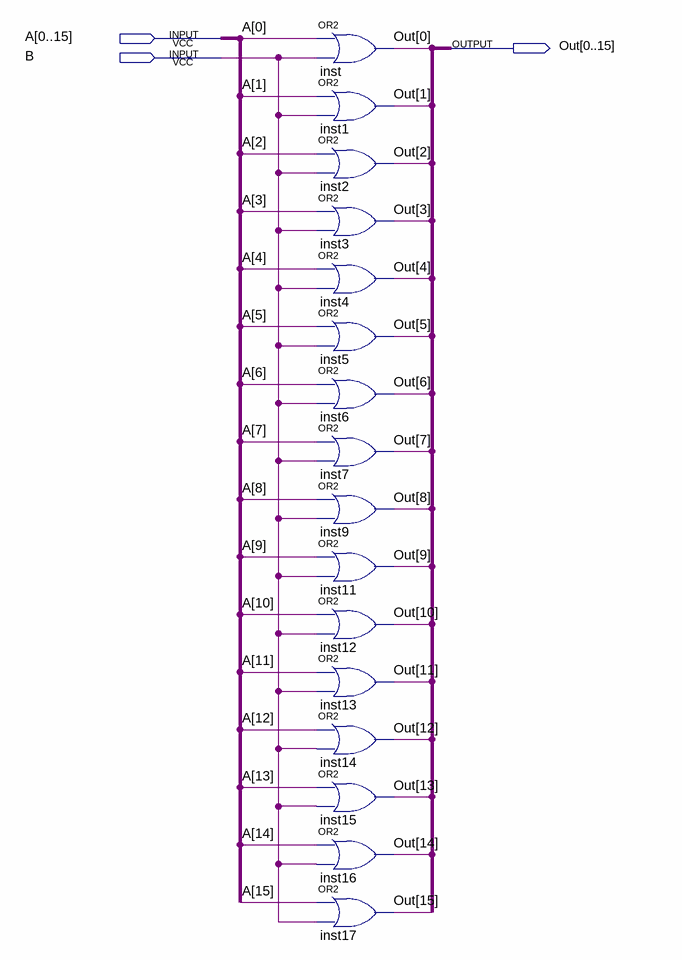
[diagram p0: schematic sheet]
// Quartus schematic or_bus16.bdf as structural Verilog: 16 symbols, 3 pins
module or_bus16 (
  input  [0:15] A,
  input  B,
  output [0:15] Out
);

  or inst (Out[0], A[0], B);
  or inst1 (Out[1], A[1], B);
  or inst2 (Out[2], A[2], B);
  or inst3 (Out[3], A[3], B);
  or inst4 (Out[4], A[4], B);
  or inst5 (Out[5], A[5], B);
  or inst6 (Out[6], A[6], B);
  or inst7 (Out[7], A[7], B);
  or inst9 (Out[8], A[8], B);
  or inst11 (Out[9], A[9], B);
  or inst12 (Out[10], A[10], B);
  or inst13 (Out[11], A[11], B);
  or inst14 (Out[12], A[12], B);
  or inst15 (Out[13], A[13], B);
  or inst16 (Out[14], A[14], B);
  or inst17 (Out[15], A[15], B);
endmodule
